# EAGLE schematic display (EAGLE 9.0.1)
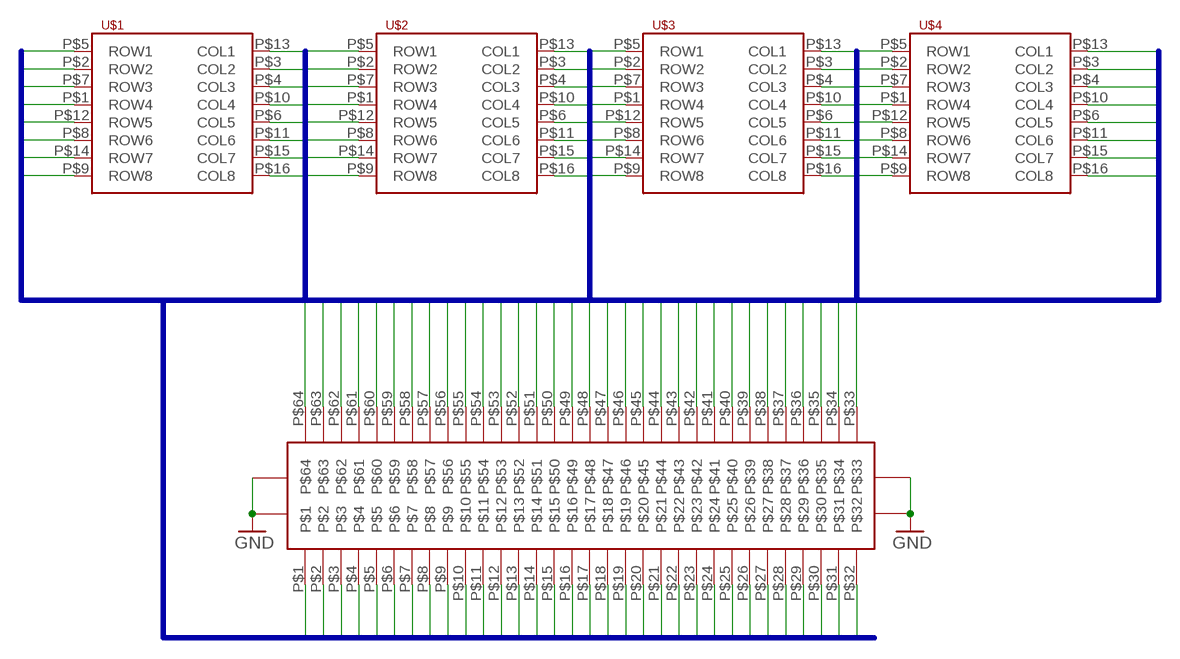
[diagram p0: schematic, sheet 1]

## Parts
U$1  LED_8X8_MATRIX07088BH  [MATRIX_8X8_20MM]
U$2  LED_8X8_MATRIX07088BH  [MATRIX_8X8_20MM]
U$3  LED_8X8_MATRIX07088BH  [MATRIX_8X8_20MM]
U$4  LED_8X8_MATRIX07088BH  [MATRIX_8X8_20MM]
U$5  ANGLE_BOARD_CONNECTORONE_SIDED  [ONE_SIDED]

## Nets
GND: U$5.GND@1(GND) U$5.GND@2(GND) U$5.GND@3(GND) U$5.GND@4(GND)
M1C1: U$1.P$13(COL1) U$5.P$64
M1C2: U$1.P$3(COL2) U$5.P$63
M1C3: U$1.P$4(COL3) U$5.P$62
M1C4: U$1.P$10(COL4) U$5.P$61
M1C5: U$1.P$6(COL5) U$5.P$60
M1C6: U$1.P$11(COL6) U$5.P$59
M1C7: U$1.P$15(COL7) U$5.P$58
M1C8: U$1.P$16(COL8) U$5.P$57
M1R1: U$1.P$5(ROW1) U$5.P$1
M1R2: U$1.P$2(ROW2) U$5.P$2
M1R3: U$1.P$7(ROW3) U$5.P$3
M1R4: U$1.P$1(ROW4) U$5.P$4
M1R5: U$1.P$12(ROW5) U$5.P$5
M1R6: U$1.P$8(ROW6) U$5.P$6
M1R7: U$1.P$14(ROW7) U$5.P$7
M1R8: U$1.P$9(ROW8) U$5.P$8
M2C1: U$2.P$13(COL1) U$5.P$56
M2C2: U$2.P$3(COL2) U$5.P$55
M2C3: U$2.P$4(COL3) U$5.P$54
M2C4: U$2.P$10(COL4) U$5.P$53
M2C5: U$2.P$6(COL5) U$5.P$52
M2C6: U$2.P$11(COL6) U$5.P$51
M2C7: U$2.P$15(COL7) U$5.P$50
M2C8: U$2.P$16(COL8) U$5.P$49
M2R1: U$2.P$5(ROW1) U$5.P$9
M2R2: U$2.P$2(ROW2) U$5.P$10
M2R3: U$2.P$7(ROW3) U$5.P$11
M2R4: U$2.P$1(ROW4) U$5.P$12
M2R5: U$2.P$12(ROW5) U$5.P$13
M2R6: U$2.P$8(ROW6) U$5.P$14
M2R7: U$2.P$14(ROW7) U$5.P$15
M2R8: U$2.P$9(ROW8) U$5.P$16
M3C1: U$3.P$13(COL1) U$5.P$48
M3C2: U$3.P$3(COL2) U$5.P$47
M3C3: U$3.P$4(COL3) U$5.P$46
M3C4: U$3.P$10(COL4) U$5.P$45
M3C5: U$3.P$6(COL5) U$5.P$44
M3C6: U$3.P$11(COL6) U$5.P$43
M3C7: U$3.P$15(COL7) U$5.P$42
M3C8: U$3.P$16(COL8) U$5.P$41
M3R1: U$3.P$5(ROW1) U$5.P$17
M3R2: U$3.P$2(ROW2) U$5.P$18
M3R3: U$3.P$7(ROW3) U$5.P$19
M3R4: U$3.P$1(ROW4) U$5.P$20
M3R5: U$3.P$12(ROW5) U$5.P$21
M3R6: U$3.P$8(ROW6) U$5.P$22
M3R7: U$3.P$14(ROW7) U$5.P$23
M3R8: U$3.P$9(ROW8) U$5.P$24
M4C1: U$4.P$13(COL1) U$5.P$40
M4C2: U$4.P$3(COL2) U$5.P$39
M4C3: U$4.P$4(COL3) U$5.P$38
M4C4: U$4.P$10(COL4) U$5.P$37
M4C5: U$4.P$6(COL5) U$5.P$36
M4C6: U$4.P$11(COL6) U$5.P$35
M4C7: U$4.P$15(COL7) U$5.P$34
M4C8: U$4.P$16(COL8) U$5.P$33
M4R1: U$4.P$5(ROW1) U$5.P$25
M4R2: U$4.P$2(ROW2) U$5.P$26
M4R3: U$4.P$7(ROW3) U$5.P$27
M4R4: U$4.P$1(ROW4) U$5.P$28
M4R5: U$4.P$12(ROW5) U$5.P$29
M4R6: U$4.P$8(ROW6) U$5.P$30
M4R7: U$4.P$14(ROW7) U$5.P$31
M4R8: U$4.P$9(ROW8) U$5.P$32

## Buses
M1C1,M1C2,M1C3,M1C4,M1C5,M1C6,M1C7,M1C8,M1R1,M1R2,M1R3,M1R4,M1R5,M1R6,M1R7,M1R8,M2C1,M2C2,M2C3,M2C4,M2C5,M2C6,M2C7,M2C8,M2R1,M2R2,M2R3,M2R4,M2R5,M2R6,M2R7,M2R8,M3C1,M3C2,M3C3,M3C4,M3C5,M3C6,M3C7,M3C8,M3R1,M3R2,M3R3,M3R4,M3R5,M3R6,M3R7,M3R8,M4C1,M4C2,M4C3,M4C4,M4C5,M4C6,M4C7,M4C8,M4R1,M4R2,M4R3,M4R4,M4R5,M4R6,M4R7,M4R8

## Library data of the parts
U$1-U$4 = LED:LED_8X8_MATRIX: CPD-15088A YGD2/A Green 8x8 LED matrix
U$5 = interboard:ANGLE_BOARD_CONNECTOR: Angle interboard connector